# EAGLE design IR Remote Rev C (EAGLE 9.7.0)
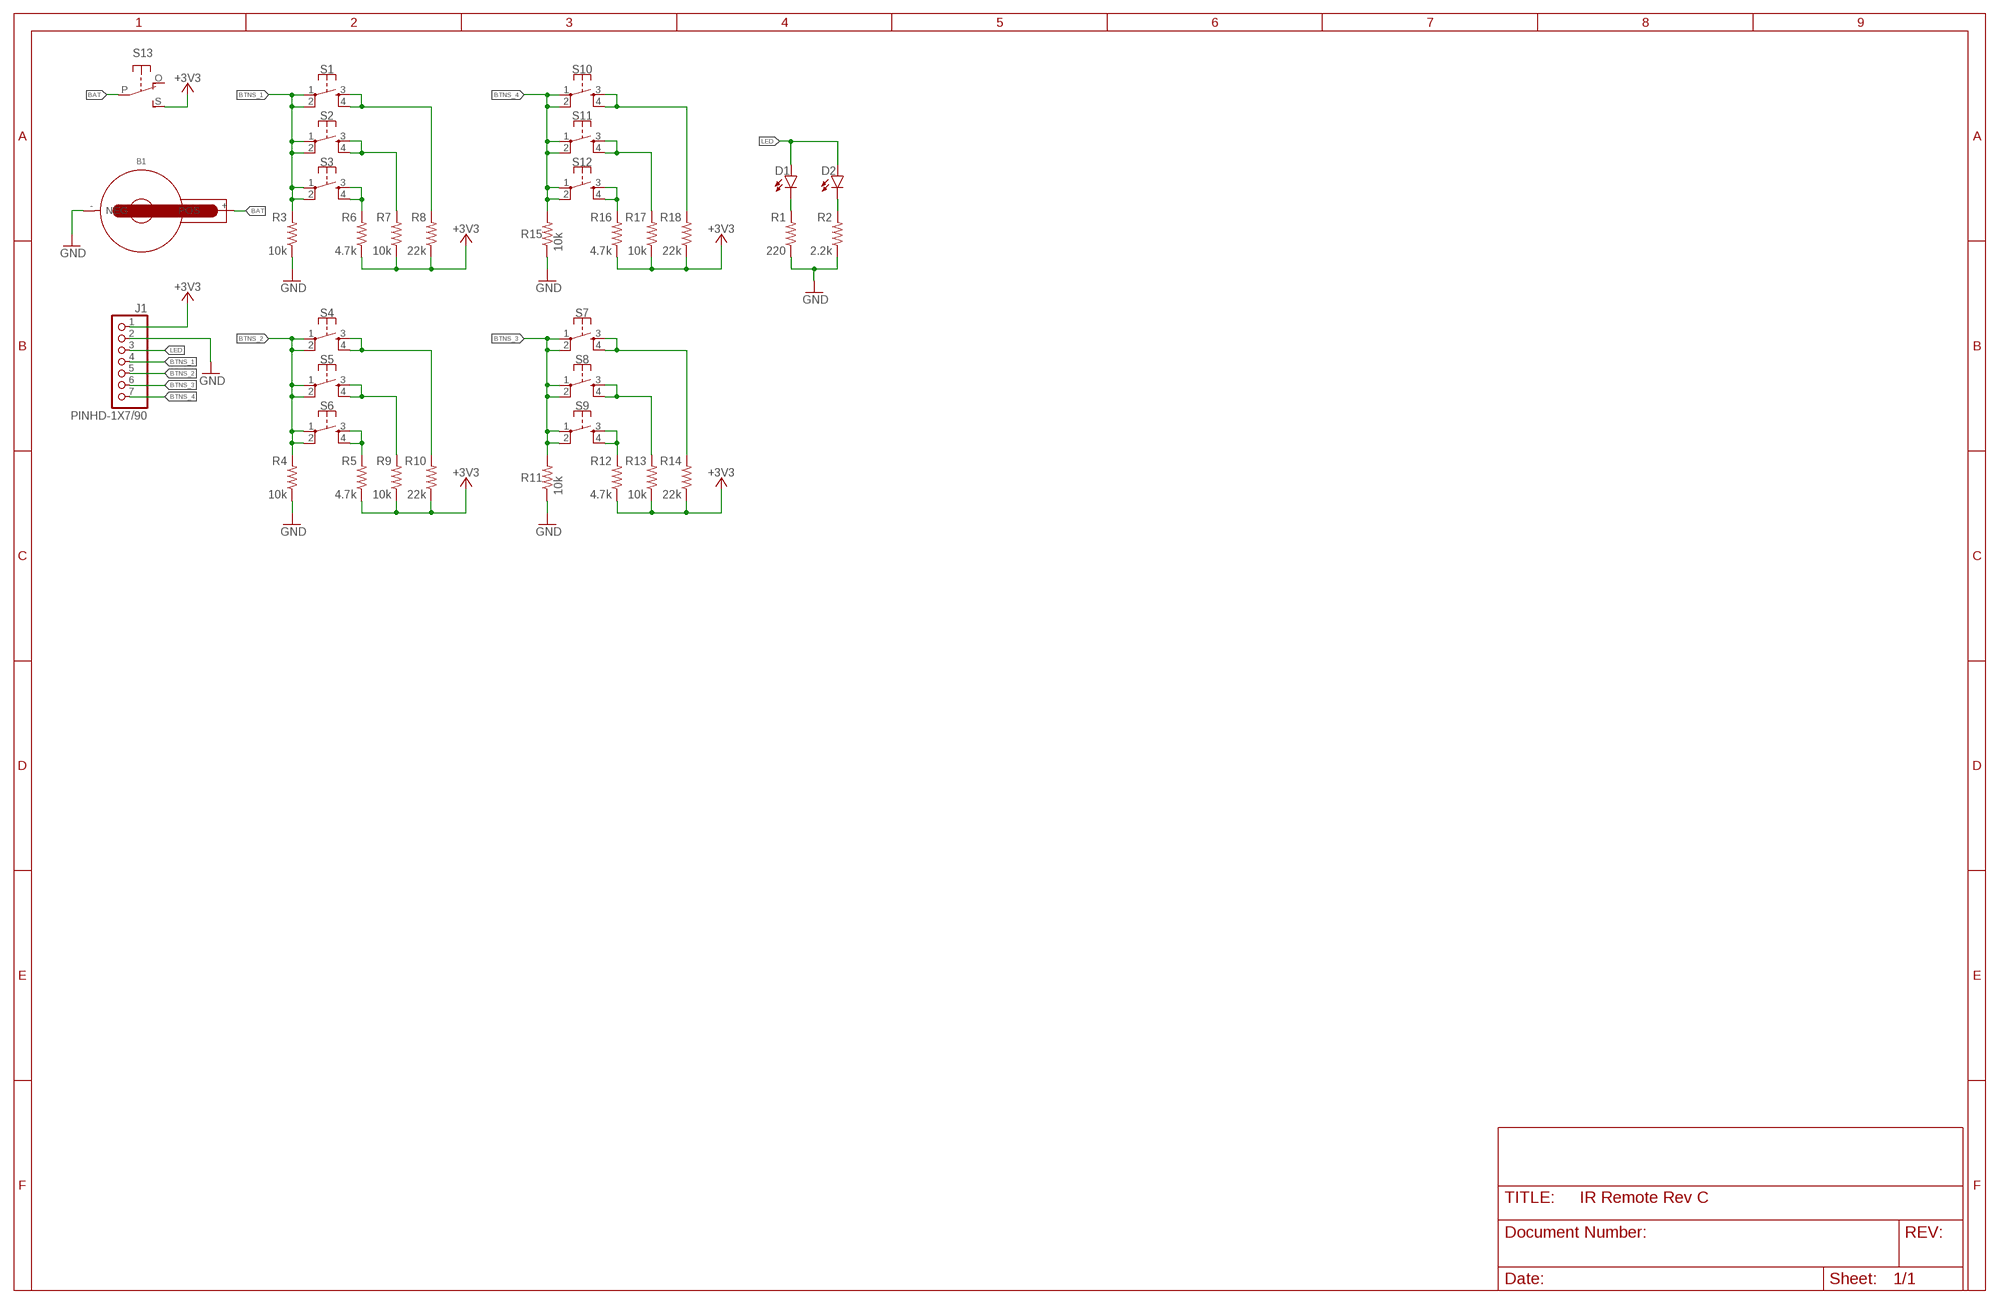
[diagram p0: schematic, sheet 1]

## Parts
B1  WA-BCPH_79578211  [WA-BCPH_79578211]
D1  LED90  [LED5MM-90]
D2  LED90  [LED5MM-90]
J1  PINHD-1X7/90  [1X07/90]
R1  220  RESISTOR  [0207/10]
R2  2.2k  RESISTOR  [0207/10]
R3  10k  RESISTOR  [0207/10]
R4  10k  RESISTOR  [0207/10]
R5  4.7k  RESISTOR  [0207/10]
R6  4.7k  RESISTOR  [0207/10]
R7  10k  RESISTOR  [0207/10]
R8  22k  RESISTOR  [0207/10]
R9  10k  RESISTOR  [0207/10]
R10  22k  RESISTOR  [0207/10]
R11  10k  RESISTOR  [0207/10]
R12  4.7k  RESISTOR  [0207/10]
R13  10k  RESISTOR  [0207/10]
R14  22k  RESISTOR  [0207/10]
R15  10k  RESISTOR  [0207/10]
R16  4.7k  RESISTOR  [0207/10]
R17  10k  RESISTOR  [0207/10]
R18  22k  RESISTOR  [0207/10]
S1  TACTILE-BUTTON40XX  [B3F-40XX]
S2  TACTILE-BUTTON40XX  [B3F-40XX]
S3  TACTILE-BUTTON40XX  [B3F-40XX]
S4  TACTILE-BUTTON40XX  [B3F-40XX]
S5  TACTILE-BUTTON40XX  [B3F-40XX]
S6  TACTILE-BUTTON40XX  [B3F-40XX]
S7  TACTILE-BUTTON40XX  [B3F-40XX]
S8  TACTILE-BUTTON40XX  [B3F-40XX]
S9  TACTILE-BUTTON40XX  [B3F-40XX]
S10  TACTILE-BUTTON40XX  [B3F-40XX]
S11  TACTILE-BUTTON40XX  [B3F-40XX]
S12  TACTILE-BUTTON40XX  [B3F-40XX]
S13  SLIDE-SWITCHSIDE  [EG1270-90]

## Nets
+3V3: J1.1 R5.1 R6.1 R7.1 R8.1 R9.1 R10.1 R12.1 R13.1 R14.1 R16.1 R17.1 R18.1 S13.S
BAT: B1.+(POS) S13.P
BTNS_1: J1.4 R3.2 S1.1(P) S1.2(P1) S2.1(P) S2.2(P1) S3.1(P) S3.2(P1)
BTNS_2: J1.5 R4.2 S4.1(P) S4.2(P1) S5.1(P) S5.2(P1) S6.1(P) S6.2(P1)
BTNS_3: J1.6 R11.2 S7.1(P) S7.2(P1) S8.1(P) S8.2(P1) S9.1(P) S9.2(P1)
BTNS_4: J1.7 R15.2 S10.1(P) S10.2(P1) S11.1(P) S11.2(P1) S12.1(P) S12.2(P1)
GND: B1.-(NEG) J1.2 R1.1 R2.1 R3.1 R4.1 R11.1 R15.1
LED: D1.A D2.A J1.3
N$2: R5.2 S6.3(S) S6.4(S1)
N$3: R6.2 S3.3(S) S3.4(S1)
N$5: R7.2 S2.3(S) S2.4(S1)
N$6: R8.2 S1.3(S) S1.4(S1)
N$7: R9.2 S5.3(S) S5.4(S1)
N$8: R10.2 S4.3(S) S4.4(S1)
N$9: R12.2 S9.3(S) S9.4(S1)
N$10: R13.2 S8.3(S) S8.4(S1)
N$11: R14.2 S7.3(S) S7.4(S1)
N$12: R16.2 S12.3(S) S12.4(S1)
N$13: R17.2 S11.3(S) S11.4(S1)
N$14: R18.2 S10.3(S) S10.4(S1)
N$16: D2.K(C) R2.2
N$17: D1.K(C) R1.2
Unconnected: S13.O

## Library data of the parts
B1 = Wurth_Assembly_WA-BCPH:WA-BCPH: WA-BCPH Battery Holder PACKAGING PROPERTIES Packaging Tape and Reel;​ Bag PROPERTIES Material Phosphor Bronze Color White;​ Black Surface Gold over Nickel;​ Tin over Nickel;​ Nickel Flammability Rating according to UL94 V-0 <https://katalog.we-online.de/media/images/v2/o160206v209%20Family_BCPH_79548211.jpg> Details see: https://katalog.we-online.de/en/em/BCPH_BATTERY_HOLDER Updated by Ella Wu,2019-10-10 2019 (C) Wurth Elektronik; BATTERY-TYPE: 2450; DATASHEET-URL: https://katalog.we-online.de/em/datasheet/79578211.pdf; MOUNT: THT; PART-NUMBER: 79578211
D1 D2 = Quantum Projects:LED
J1 = Connector:PINHD-1X7: PIN HEADER; CATEGORY: CONNECTOR; SUB-CATEGORY: PIN-HEADER
R1-R18 = Quantum Projects:RESISTOR
S1-S12 = Quantum Projects:TACTILE-BUTTON
S13 = Quantum Projects:SLIDE-SWITCH

## Board
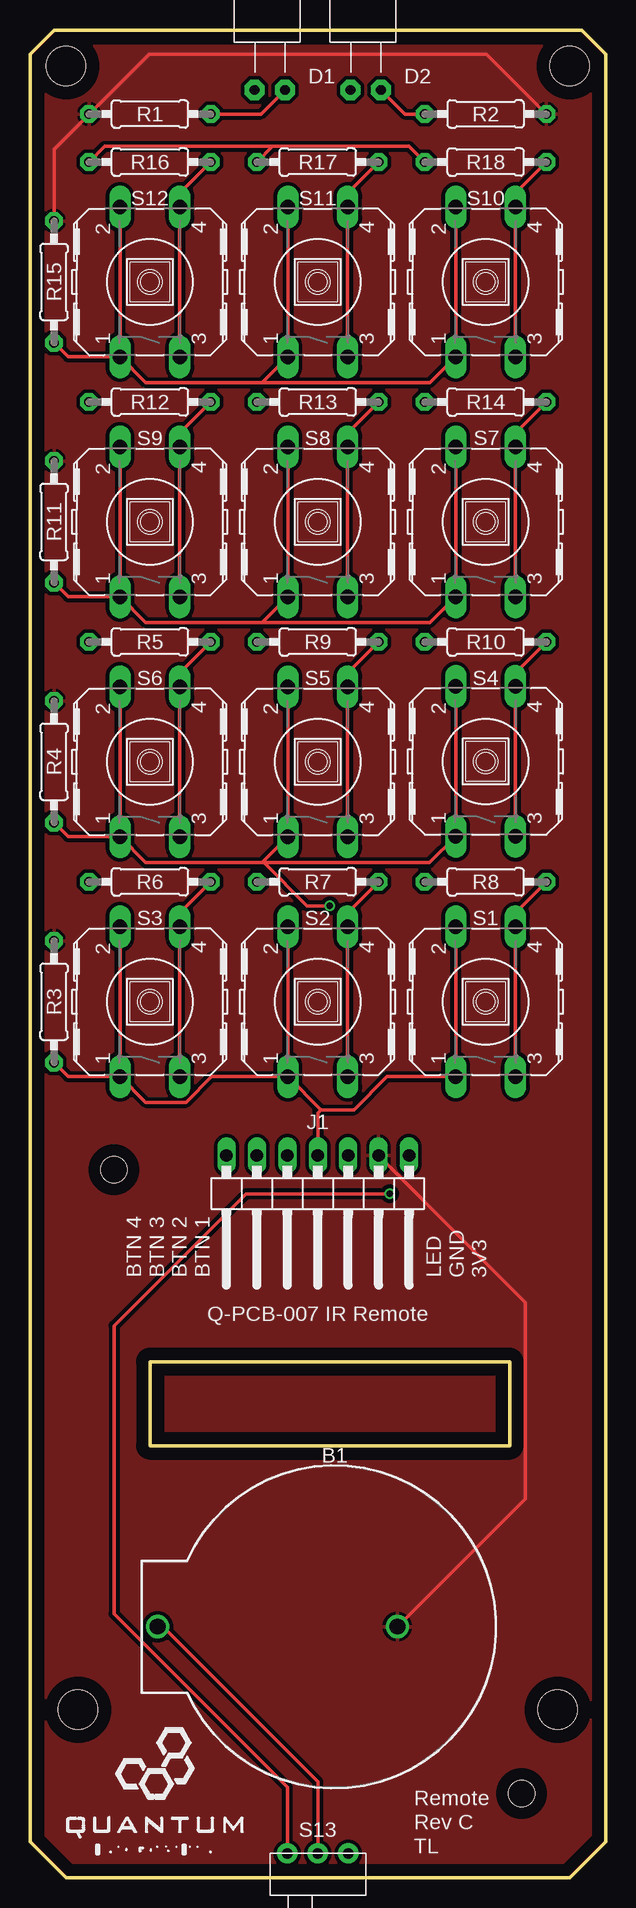
[diagram p1: board, top side]
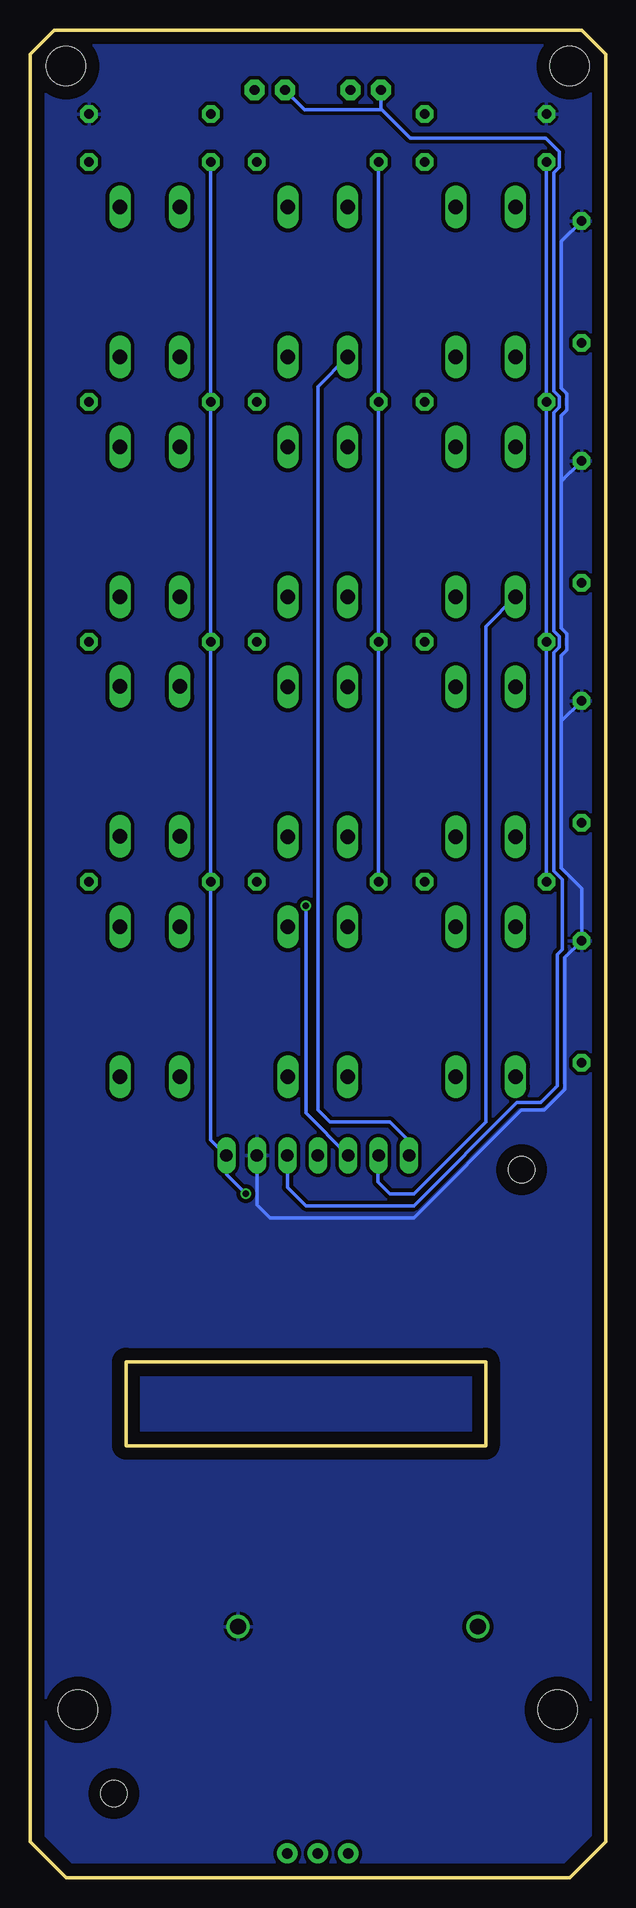
[diagram p2: board, bottom side, seen from below]

Size 48 x 154 mm. Coordinates in mm from the lower left corner, seen from the top.
Outline: 2,154 46,154 48,152 48,3 45,0 3,0 0,3 0,152 2,154
Outline: 10,36 40,36 40,43 10,43 10,36
Copper layers (1*16): Top 0.035mm / dielectric 1.5mm / Bottom 0.035mm
Design rules "quantum-drc *": minimum track width 12mil, minimum drill 0.35mm, track to track 12mil, track to pad 8mil, pad to pad 12mil, via to via 10mil, smd to smd 6mil, copper to edge 40mil, drill to drill 6mil, minimum pad ring 10mil, minimum via ring 8mil, stop-mask expansion 4mil, vias tented up to drill 50mil, thermal gap 10mil
Holes 2.2 mm at 41,7 7,59
Holes 3.25 mm at 4,14 44,14 3,151 45,151
tRestrict: area 5,57 to 9,61; area 39,5 to 43,9; area 0.2,148.2 to 5.8,153.8; area 42.2,148.2 to 47.8,153.8; area 41.2,11.2 to 46.8,16.8; area 1.2,11.2 to 6.8,16.8
bRestrict: area 5,57 to 9,61; area 39,5 to 43,9; area 42.2,148.2 to 47.8,153.8; area 0.2,148.2 to 5.8,153.8; area 1.2,11.2 to 6.8,16.8; area 41.2,11.2 to 46.8,16.8

### Footprints (pad centres in the part's own frame; a part is rotated, then mirrored left to right if it is on the bottom)
WA-BCPH_79578211 = drill 1.3: + -14.755,0; - 5.245,0
LED5MM-90 = drill 0.813 pad 1.676 octagon: A -1.27,0; K 1.27,0
1X07/90 = drill 1.016 long: 1 -7.62,-3.81; 2 -5.08,-3.81; 3 -2.54,-3.81; 4 0,-3.81; 5 2.54,-3.81; 6 5.08,-3.81; 7 7.62,-3.81
0207/10 = drill 0.813 pad 1.43 octagon: 1 -5.08,0; 2 5.08,0
B3F-40XX = drill 1.194 long: 1 -6.248,2.489; 2 6.248,2.489; 3 -6.248,-2.489; 4 6.248,-2.489
EG1270-90 = drill 0.9 pad 1.676: O -2.54,0; P 0,0; S 2.54,0

### Placement (x,y rotation side)
B1  25.4,20.9 0 top
D1  20,149 0 top
D2  28,149 0 top
J1  24,56.37 180 top
R1  10,147 0 top
R2  38,147 180 top
R3  2,73 270 top
R4  2,93 270 top
R5  10,103 0 top
R6  10,83 0 top
R7  24,83 0 top
R8  38,83 0 top
R9  24,103 0 top
R10  38,103 0 top
R11  2,113 270 top
R12  10,123 0 top
R13  24,123 0 top
R14  38,123 0 top
R15  2,133 270 top
R16  10,143 0 top
R17  24,143 0 top
R18  38,143 0 top
S1  38,73 90 top
S2  24,73 90 top
S3  10,73 90 top
S4  38,93.03 90 top
S5  24,93 90 top
S6  10,93 90 top
S7  38,113 90 top
S8  24,113 90 top
S9  10,113 90 top
S10  38,133 90 top
S11  24,133 90 top
S12  10,133 90 top
S13  24,2.01 180 top

### Tracks (layer width: path | path; a pad name or v marks a point on that pad's centre or on a via)
+3V3  (via drill 0.51)
  Top 0.305: S13.S 21.46,7.54 7,22 7,46 18,57 v30,57 | R16.1 6.22,144.3 20.22,144.3 | 20.22,144.3 31.62,144.3 R18.1 | R17.1 20.22,144.3
  Bottom 0.305: R16.1 R12.1 R5.1 R6.1 | R7.1 R9.1 R13.1 R17.1 | R18.1 R14.1 R10.1 R8.1 32.92,61.48 J1.1 31.62,58.62 v30,57
BAT
  Top 0.305: S13.P 24,8 11.1,20.9 B1.+
BTNS_1
  Top 0.305: S2.1 S2.2 | S3.1 S3.2 | R3.2 3.17,66.75 S3.1 | S3.1 9.66,64.61 13.01,64.61 15.15,66.75 S2.1 | 24.26,64 27,64 29.75,66.75 S1.1 S1.2 | 24.26,64 S2.1 | 24.26,64 24,63.74 J1.4
BTNS_2  (via drill 0.51)
  Top 0.305: S6.1 S6.2 | S5.2 S5.1 19.36,84.6 | S4.2 S4.1 33.33,84.6 19.5,84.6 | R4.2 3.17,86.75 S6.1 | S6.1 9.66,84.6 19.36,84.6 | 19.36,84.6 19.5,84.6 | 19.5,84.6 23.1,81 v25,81
  Bottom 0.305: J1.5 25,63.72 v25,81
BTNS_3
  Top 0.305: S7.2 S7.1 33.36,104.61 19.36,104.61 | S8.2 S8.1 19.36,104.61 | S9.2 S9.1 | R11.2 3.17,106.75 S9.1 | S9.1 9.66,104.61 19.36,104.61
  Bottom 0.305: S9.1 10,104.26 10,63 16,57 18,57 19,58 19,60.1 J1.6
BTNS_4
  Top 0.305: S12.1 S12.2 | S11.2 S11.1 19.36,124.61 | S10.2 S10.1 33.36,124.61 19.36,124.61 | R15.2 3.17,126.75 S12.1 | S12.1 9.66,124.61 19.36,124.61
  Bottom 0.305: S11.1 24,124.26 24,64 23,63 18,63 16.38,61.38 J1.7
GND
  Top 0.305: R15.1 2,144.08 R1.1 9.92,152 38.08,152 R2.1 | B1.- 41.32,31.58 41.32,47.94 J1.2
  Bottom 0.305: R15.1 3.7,136.38 3.7,124.16 3.24,123.7 3.24,122.3 3.7,121.84 3.7,116.38 | 3.7,116.38 3.7,104.16 3.24,103.7 3.24,102.3 3.7,101.84 3.7,96.38 | 3.7,96.38 3.7,84.16 2,82.46 R3.1 3.4,76.68 3.4,65.71 5.11,64 7,64 16,55 28,55 29.08,56.08 J1.2 | R4.1 3.7,96.38 | R11.1 3.7,116.38
  pour Top: 3.06,0.15 44.94,0.15 47.85,3.06 47.85,151.94 45.94,153.85 2.06,153.85 0.15,151.94 0.15,3.06
  pour Bottom: 3.06,0.15 44.94,0.15 47.85,3.06 47.85,151.94 45.94,153.85 2.06,153.85 0.15,151.94 0.15,3.06
LED
  Bottom 0.305: J1.3 26.54,57.54 25,56 16,56 7.39,64.61 5.4,64.61 4.01,66 4.01,76.93 3.6,77.34 3.6,83.19 4.31,83.9 4.31,102.1 3.85,102.56 3.85,103.44 4.31,103.9 4.31,122.1 3.85,122.56 3.85,123.44 4.31,123.9 4.31,142.1 3.85,142.56 3.85,143.85 5,145 16.27,145 18.64,147.37 | 18.64,147.37 18.73,147.46 D1.A | 18.64,147.37 25.09,147.37 D2.A
N$2
  Top 0.305: R5.2 12.49,100.41 S6.4 S6.3
N$3
  Top 0.305: S3.3 S3.4 12.49,80.41 R6.2
N$5
  Top 0.305: R7.2 26.49,80.41 S2.4 S2.3
N$6
  Top 0.305: R8.2 40.49,80.41 S1.4 S1.3
N$7
  Top 0.305: S5.3 S5.4 26.49,100.41 R9.2
N$8
  Top 0.305: R10.2 40.49,100.41 S4.4 S4.3
N$9
  Top 0.305: R12.2 12.49,120.41 S9.4 S9.3
N$10
  Top 0.305: S8.3 S8.4 26.49,120.41 R13.2
N$11
  Top 0.305: R14.2 40.49,120.41 S7.4 S7.3
N$12
  Top 0.305: S12.3 S12.4 12.49,140.41 R16.2
N$13
  Top 0.305: S11.3 S11.4 26.49,140.41 R17.2
N$14
  Top 0.305: S10.3 S10.4 40.49,140.41 R18.2
N$16
  Top 0.305: D2.K 31.27,147 R2.2
N$17
  Top 0.305: R1.2 19.27,147 D1.K

### Text on the board
tNames: BTN 4 / BTN 3 / BTN 2 / BTN 1 | LED / GND / 3V3 | Q-PCB-007 IR Remote | Remote | Rev C | TL